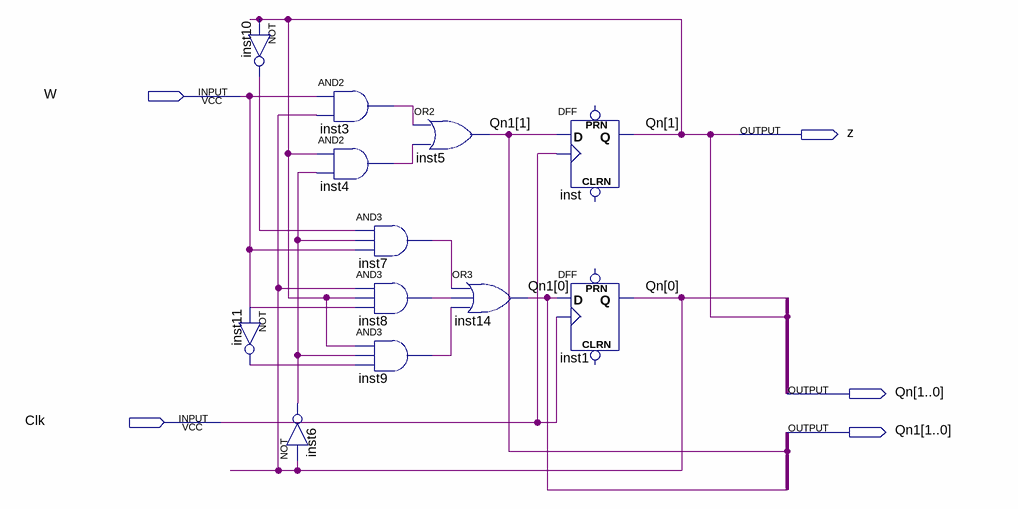
[diagram p0: schematic sheet]
// Quartus schematic FSM_circuit.bdf as structural Verilog: 12 symbols, 5 pins
module FSM_circuit (
  input  W,
  input  Clk,
  output z,
  output [1:0] Qn,
  output [1:0] Qn1
);

  wire inst3_out, inst4_out, inst6_out, inst7_out, inst8_out, inst9_out, inst10_out, inst11_out;

  not inst10 (inst10_out, Qn[1]);
  not inst11 (inst11_out, W);
  not inst6 (inst6_out, Qn[0]);
  and inst3 (inst3_out, W, Qn[0]);
  and inst4 (inst4_out, Qn[1], inst6_out);
  and inst7 (inst7_out, inst10_out, inst6_out, W);
  and inst8 (inst8_out, Qn[0], Qn[1], W);
  and inst9 (inst9_out, Qn[1], inst6_out, inst11_out);
  or inst5 (Qn1[1], inst3_out, inst4_out);
  or inst14 (Qn1[0], inst7_out, inst8_out, inst9_out);
  DFF inst (.CLK(Clk), .D(Qn1[1]), .Q(Qn[1]));  // open: CLRN, PRN
  DFF inst1 (.CLK(Clk), .D(Qn1[0]), .Q(Qn[0]));  // open: CLRN, PRN

  assign z = Qn[1];
endmodule
